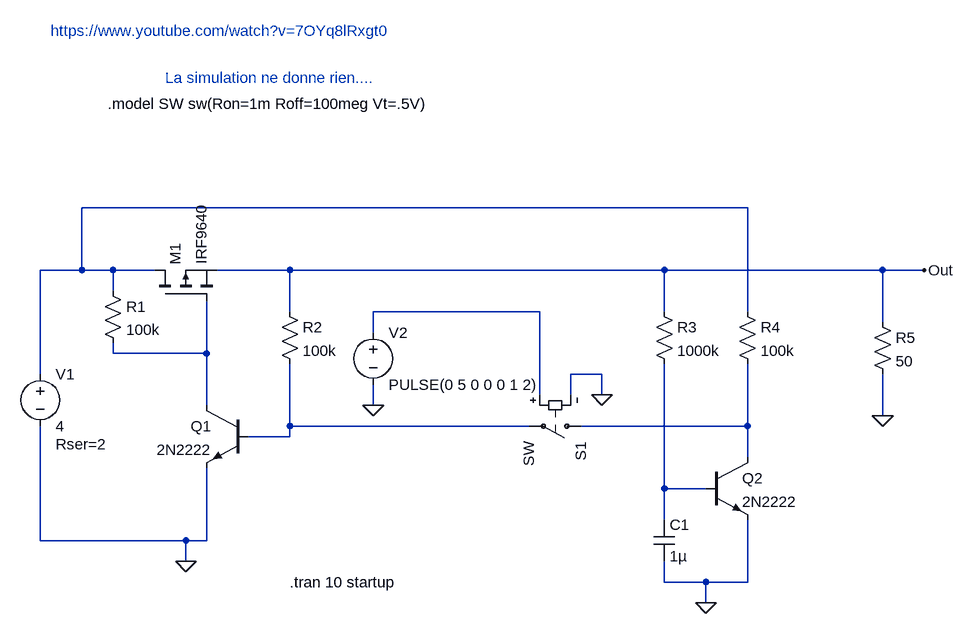
[diagram p0: schematic On-button-Switch-mosfet-EEVblog.asc]
On-button-Switch-mosfet-EEVblog.asc, the LTspice schematic file:
Version 4
SHEET 1 1244 680
WIRE 912 -288 -112 -288
WIRE -112 -192 -112 -288
WIRE -112 -192 -176 -192
WIRE -64 -192 -112 -192
WIRE 0 -192 -64 -192
WIRE 208 -192 96 -192
WIRE 784 -192 208 -192
WIRE 1120 -192 784 -192
WIRE 1184 -192 1120 -192
WIRE -64 -160 -64 -192
WIRE 208 -128 208 -192
WIRE 592 -128 336 -128
WIRE 784 -128 784 -192
WIRE 912 -128 912 -288
WIRE 1120 -112 1120 -192
WIRE 336 -96 336 -128
WIRE -64 -64 -64 -80
WIRE 80 -64 80 -144
WIRE 80 -64 -64 -64
WIRE -176 -32 -176 -192
WIRE 688 -32 640 -32
WIRE 592 0 592 -128
WIRE 640 0 640 -32
WIRE 688 0 688 -32
WIRE 80 16 80 -64
WIRE 336 16 336 -16
WIRE 1120 32 1120 -32
WIRE 208 48 208 -48
WIRE 576 48 208 48
WIRE 912 48 912 -48
WIRE 912 48 656 48
WIRE 208 64 208 48
WIRE 208 64 144 64
WIRE 912 96 912 48
WIRE 784 144 784 -48
WIRE 848 144 784 144
WIRE 784 192 784 144
WIRE -176 224 -176 48
WIRE 48 224 -176 224
WIRE 80 224 80 112
WIRE 80 224 48 224
WIRE 48 256 48 224
WIRE 784 288 784 256
WIRE 848 288 784 288
WIRE 912 288 912 192
WIRE 912 288 848 288
WIRE 848 320 848 288
FLAG 48 256 0
FLAG 688 0 0
FLAG 336 16 0
FLAG 848 320 0
FLAG 1184 -192 Out
FLAG 1120 32 0
SYMBOL voltage -176 -48 R0
WINDOW 123 0 0 Left 0
WINDOW 39 24 124 Left 2
SYMATTR InstName V1
SYMATTR Value 4
SYMATTR SpiceLine Rser=2
SYMBOL sw 672 48 R90
SYMATTR InstName S1
SYMBOL voltage 336 -112 R0
WINDOW 123 0 0 Left 0
WINDOW 39 0 0 Left 0
SYMATTR InstName V2
SYMATTR Value PULSE(0 5 0 0 0 1 2)
SYMBOL pmos 0 -144 R270
SYMATTR InstName M1
SYMATTR Value IRF9640
SYMBOL res -80 -176 R0
SYMATTR InstName R1
SYMATTR Value 100k
SYMBOL npn 144 16 M0
SYMATTR InstName Q1
SYMATTR Value 2N2222
SYMBOL res 192 -144 R0
SYMATTR InstName R2
SYMATTR Value 100k
SYMBOL res 768 -144 R0
SYMATTR InstName R3
SYMATTR Value 1000k
SYMBOL res 896 -144 R0
SYMATTR InstName R4
SYMATTR Value 100k
SYMBOL npn 848 96 R0
SYMATTR InstName Q2
SYMATTR Value 2N2222
SYMBOL cap 768 192 R0
SYMATTR InstName C1
SYMATTR Value 1µ
SYMBOL res 1104 -128 R0
SYMATTR InstName R5
SYMATTR Value 50
TEXT 208 288 Left 2 !.tran 10 startup
TEXT -72 -448 Left 2 !.model SW sw(Ron=1m Roff=100meg Vt=.5V)
TEXT -160 -560 Left 2 ;https://www.youtube.com/watch?v=7OYq8lRxgt0
TEXT 16 -488 Left 2 ;La simulation ne donne rien....

The netlist it stands for:
* On-button-Switch-mosfet-EEVblog.asc
V1 N001 0 4 Rser=2
S1 N005 N004 N002 0 SW
V2 N002 0 PULSE(0 5 0 0 0 1 2)
M1 N001 N003 Out Out IRF9640
R1 N001 N003 100k
Q1 N003 N004 0 0 2N2222
R2 Out N004 100k
R3 Out N006 1000k
R4 N001 N005 100k
Q2 N005 N006 0 0 2N2222
C1 N006 0 1µ
R5 Out 0 50
.model NPN NPN
.model PNP PNP
.lib standard.bjt
.model NMOS NMOS
.model PMOS PMOS
.lib standard.mos
.tran 10 startup
.model SW sw(Ron=1m Roff=100meg Vt=.5V)
* https://www.youtube.com/watch?v=7OYq8lRxgt0
* La simulation ne donne rien....
.backanno
.end